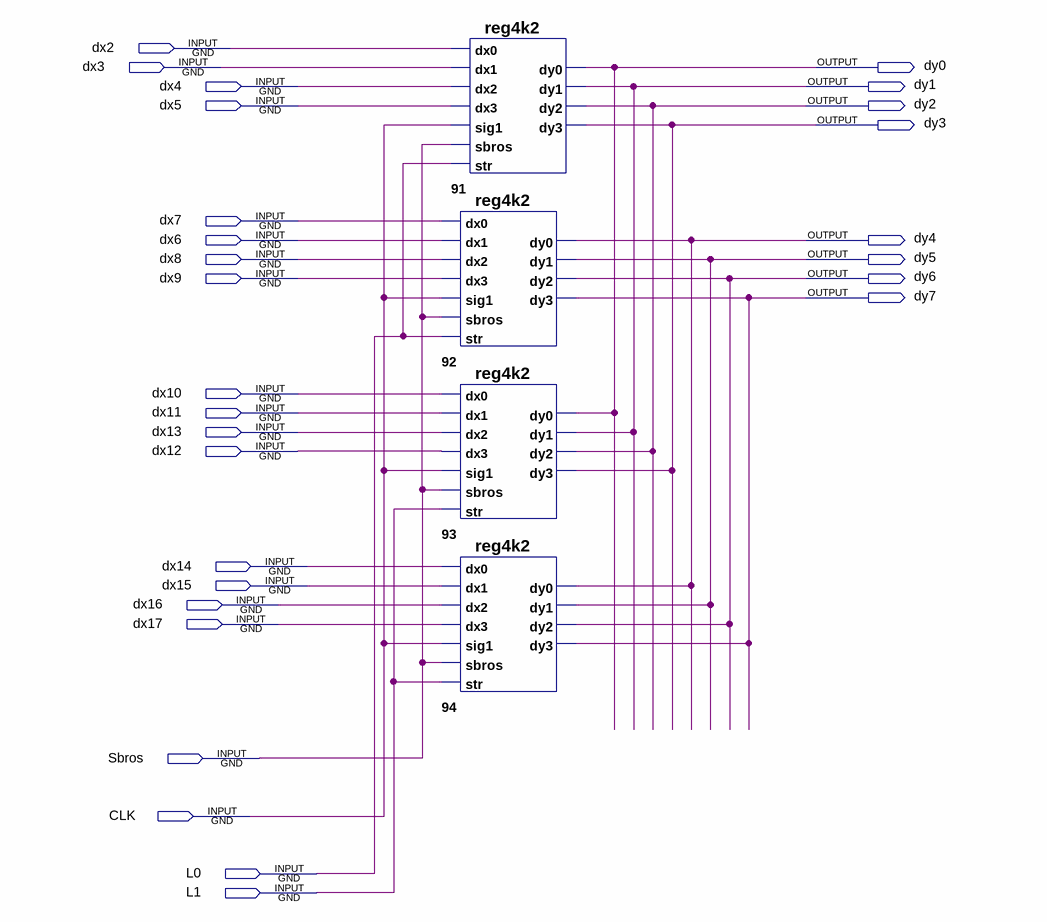
[diagram p0: schematic sheet]
// Quartus schematic rg18ALL_27DES.bdf as structural Verilog: 4 symbols, 28 pins
module rg18ALL_27DES (
  input  dx2,
  input  dx3,
  input  dx4,
  input  dx5,
  input  dx7,
  input  dx6,
  input  dx8,
  input  dx9,
  input  dx10,
  input  dx11,
  input  dx13,
  input  dx12,
  input  dx14,
  input  dx15,
  input  dx16,
  input  dx17,
  input  Sbros,
  input  CLK,
  input  L0,
  input  L1,
  output dy0,
  output dy1,
  output dy2,
  output dy3,
  output dy4,
  output dy5,
  output dy6,
  output dy7
);

  reg4k2 u_91 (
    .dx0(dx2), .dx1(dx3), .dx2(dx4), .dx3(dx5), .sig1(CLK), .sbros(Sbros), .str(L0), .dy0(dy0), .dy1(dy1),
    .dy2(dy2), .dy3(dy3));
  reg4k2 u_92 (
    .dx0(dx7), .dx1(dx6), .dx2(dx8), .dx3(dx9), .sig1(CLK), .sbros(Sbros), .str(L0), .dy0(dy4), .dy1(dy5),
    .dy2(dy6), .dy3(dy7));
  reg4k2 u_93 (
    .dx0(dx10), .dx1(dx11), .dx2(dx13), .dx3(dx12), .sig1(CLK), .sbros(Sbros), .str(L1), .dy0(dy0),
    .dy1(dy1), .dy2(dy2), .dy3(dy3));
  reg4k2 u_94 (
    .dx0(dx14), .dx1(dx15), .dx2(dx16), .dx3(dx17), .sig1(CLK), .sbros(Sbros), .str(L1), .dy0(dy4),
    .dy1(dy5), .dy2(dy6), .dy3(dy7));
endmodule
